# Altium schematic sheet 12V_Converter.SchDoc
size A; SheetNumber: 4; SheetTotal: 8
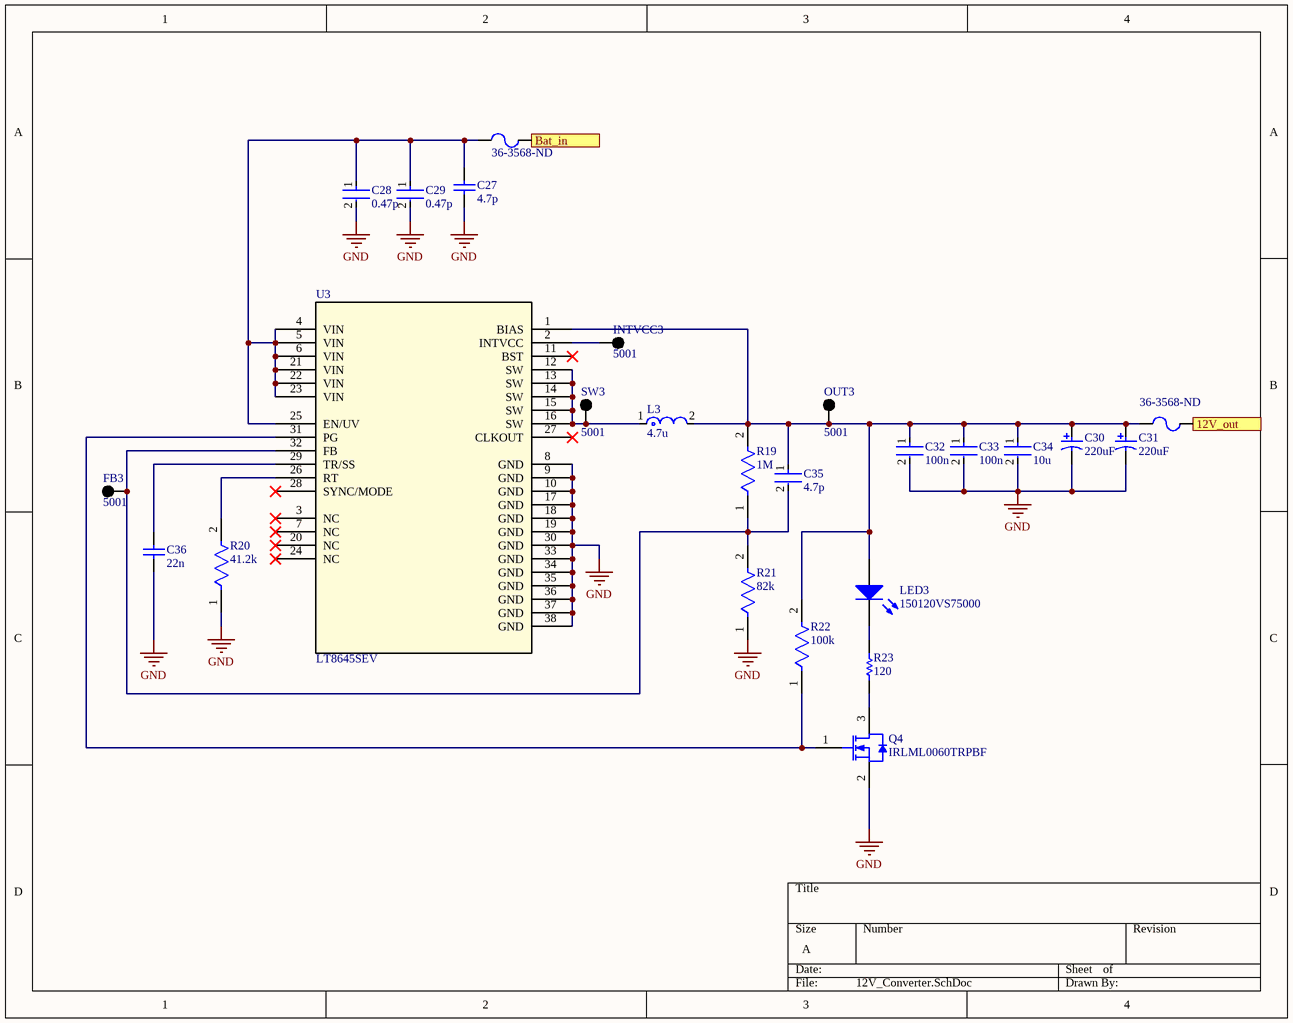
[diagram p0: 12V_Converter.SchDoc]

## Parts
C27  4.7p  [CAPC1608X90X35ML10T15]
C28  0.47p  [FP-CL21-IPC_B]
C29  0.47p  [FP-CL21-IPC_B]
C30  220uF  [CAPPR65-500-1250X1000X1350]
C31  220uF  [CAPPR65-500-1250X1000X1350]
C32  100n  [FP-CL10-IPC_A]
C33  100n  [FP-CL10-IPC_A]
C34  10u  [FP-CGA6P-IPC_A]
C35  4.7p  [FP-0603-L_1_6_0_15-W_0_81-MFG]
C36  22n  [CAPC1608X90X35ML10T15]
F5  36-3568-ND  [PCBComponent_1]
F6  36-3568-ND  [PCBComponent_1]
FB3  5001  [KSTN-5001]
INTVCC3  5001  [KSTN-5001]
L3  4.7u  [FP-XAL6060-472MEC-MFG]
LED3  150120VS75000  [1206_A]
OUT3  5001  [KSTN-5001]
Q4  IRLML0060TRPBF  [INTR-SOT-23-3_V]
R19  1M  [FP-CRCW0603-e3-MFG]
R20  41.2k  [FP-CRCW0603-e3-MFG]
R21  82k  [FP-CRCW0603-e3-IPC_C]
R22  100k  [FP-RC0603-0_55-MFG]
R23  120  [RESC1609X55X30ML15T15]
SW3  5001  [KSTN-5001]
U3  LT8645SEV  [LQFN-32]

## Ports
12V_out (out), Bat_in (in)

## Nets
GND: C27.1 C28.2 C29.2 C30.2 C31.2 C32.2 C33.2 C34.2 C36.1 Q4.2(S) R20.1 R21.1 U3.8(GND) U3.9(GND) U3.10(GND) U3.17(GND) U3.18(GND) U3.19(GND) U3.30(GND) U3.33(GND) U3.34(GND) U3.35(GND) U3.36(GND) U3.37(GND) U3.38(GND)
12V_out: F6.2 ; port 12V_out
Bat_in: F5.2 ; port Bat_in
NetC27_2: C27.2 C28.1 C29.1 F5.1 U3.4(VIN) U3.5(VIN) U3.6(VIN) U3.21(VIN) U3.22(VIN) U3.23(VIN) U3.25(EN/UV)
NetC30_1: C30.1 C31.1 C32.1 C33.1 C34.1 C35.1 F6.1 L3.2 LED3.2(A) OUT3.1 R19.2 R22.2 U3.1(BIAS)
NetC35_2: C35.2 FB3.1 R19.1 R21.2 U3.32(FB)
NetC36_2: C36.2 U3.29(TR/SS)
NetINTVCC3_1: INTVCC3.1 U3.2(INTVCC)
NetL3_1: L3.1 SW3.1 U3.12(SW) U3.13(SW) U3.14(SW) U3.15(SW) U3.16(SW)
NetLED3_1: LED3.1(K) R23.2
NetQ4_1: Q4.1(G) R22.1 U3.31(PG)
NetQ4_3: Q4.3(D) R23.1
NetR20_2: R20.2 U3.26(RT)

Not connected (* = marked no-connect by the designer): U3 3(NC)* 7(NC)* 11(BST)* 20(NC)* 24(NC)* 27(CLKOUT)* 28(SYNC/MODE)*

## Library data of the parts
C27 = CMP-2006-02676-1: Part Number: GRM1885C1H4R7CA01D; Manufacturer: Murata
C28 C29 = CMP-13271-000950-1: CL21 Series 0805 0.47pF 50V ±0.1pF Tolerance C0G Multilayer Ceramic Chip Capacitor; Temperature Coefficient: 300ppm/°C; Length: 2mm; Case Code (Metric): 2012; Width: 0.049inch; Case Code (Imperial): 0805; Radiation Hardening: No; Voltage: 50V; Height: 0.65mm; Voltage Rating (DC): 50V; Package Quantity: 1; Capacitance: 0.47pF; Voltage Rating: 50V; Max Operating Temperature: 125°C; Min Operating Temperature: -55°C; Dielectric: C0G; Depth: 1.25mm; Thickness: 0.03inch; Lead Free: Lead Free; Packaging: Tape and Reel; Case/Package: 0805; Mount: Surface Mount
C30 C31 = CMP-1665-00043-1: Aluminum Electrolytic Capacitor, 220 uF, +/- 20%, 50 V, -40 to 85 degC, 2-Pin THD, RoHS, Bulk; Max Supply Voltage: 5.5 V; Min Supply Voltage: 4.5 V; Propagation Delay: 10 us; Data Rate: 120 kbps; Nominal Supply Current: 10 mA; Case\Package: SOIC; Nominal Supply Voltage: 5 V; Channels: 2; Interface: RS-232; Width: 4 mm; Packaging: Rail/Tube; ComponentLink2Description: Datasheet; Height: 1.5 mm; PackageReference: CAPPR65-500-1250X1000X1350; Pins: 16; DatasheetVersion: Mar-16; Max Operating Temperature: 70 degC; Length: 10 mm; REACH SVHC: No SVHC; ComponentLink1Description: Manufacturer URL; Package Quantity: 50; ComponentLink2URL: http://industrial.panasonic.com/cdbs/www-data/pdf/RDF0000/DMF0000COL68.pdf; ComponentLink1URL: http://www.panasonic.com/; PackageDescription: 2-Pin Radial Lead, Dia 10 mm, Body Length 12.5 mm; Min Operating Temperature: 0 degC; Radiation Hardening: No; RoHSCompliant: true; Mount: Surface Mount
C32 C33 = CMP-13271-000587-1: Cap Ceramic 100nF 50V X7R ±10% Pad SMD 0603 +125°C T/R; Case/Package: 0603; Depth: 0.8mm; Max Operating Temperature: 125°C; Lead Free: Lead Free; Material: Ceramic; Voltage Rating: 50V; Min Operating Temperature: -55°C; Voltage Rating (DC): 50V; Dielectric: X7R; Height: 0.8mm; Capacitance: 100nF; Thickness: 0.035inch; Radiation Hardening: No; Voltage: 50V; Packaging: Tape and Reel; Length: 1.6mm; Tolerance: 10%; Width: 0.031inch; Mount: Surface Mount; Package Quantity: 10000
C34 = CMP-2000-07444-2: Cap Ceramic 10uF 50V X7S 10% Pad SMD 1210 +125°C Automotive T/R; Width: 0.098inch; Depth: 2.5mm; Capacitance: 10uF; Case Code (Metric): 3225; Case/Package: 1210; Voltage Rating: 50V; Composition: Ceramic; Min Operating Temperature: -55°C; Termination: SMD/SMT; Dielectric: X7S; Max Operating Temperature: 125°C; Length: 3.2mm; Mount: Surface Mount; Packaging: Tape and Reel; Voltage Rating (DC): 50V; Package Quantity: 1; Height: 2.5mm; Case Code (Imperial): 1210; Weight: 0.000564oz; Lead Free: Lead Free; Thickness: 0.11inch; REACH SVHC: No SVHC; Tolerance: 10%; Voltage: 50V; Ratings: AEC-Q200
C35 = CMP-2006-04327-2: General Purpose Ceramic Capacitor, 0603, 4.7pF, 0.25pF, NP0, 30ppm/°C, 50V; Insulation Resistance: 100GR; Dielectric: C0G; Case/Package: 0603; RoHS Compliant: Yes; Case Code (Imperial): 0603; Contact Plating: Tin; REACH SVHC: No SVHC; Construction: Flat; Voltage Rating: 50V; Case Code (Metric): 1608; Min Operating Temperature: -55°C; Termination: SMD/SMT; Max Operating Temperature: 125°C; Capacitance: 4.7pF; Depth: 0.81mm; Radiation Hardening: No; Lead Free: Lead Free; Mount: Surface Mount; Thickness: 0.035inch; Width: 0.81mm; Series: -; Package Quantity: 4000; Packaging: Tape and Reel; Number of Pins: 2; Temperature Coefficient: 30ppm/°C; Voltage Rating (DC): 50V; Height: 0.86mm; Length: 1.6mm
C36 = CMP-2006-02910-1: Manufacturer: Murata; Part Number: GRM188R71H223KA01D
F5 F6 = Fuse_Holder
FB3 = CMP-2000-05181-1: Test Point, Black, 1-Pin THD, RoHS, Bulk; Manufacturer: Keystone; Other Names: 5001K; Catalog Drawings: 5000Series; Alternate Color: 5004K-ND / -TESTPOINTPCMINI.040"DYELLOW / 5003K-ND / -TESTPOINTPCMINI.040"DORANGE / 5002K-ND / -TESTPOINTPCMINI.040"DWHITE / 5000K-ND / -TESTPOINTPCMINI.040"DRED; Kits: DKTGRS232C-KIT-ND / -TTLCONVERTER; Material: Base,Nylon46,UL94V-0; Type: PCTestPoint,Miniature; Online Catalog: ColorCodedTestPoints; Datasheet URL: https://ciiva.com/datasheet-click-2917627?src=ciiva&sig=bd195616; Mounting Type: 0.040"(1.02mm)HoleDiameter; Family: TestPoints; RoHS Information: RoHSComplianceStatement; Datasheet Version: Rev. G, 12/2008; Color: Black; Category: TestandMeasurement; Standard Package: 100; Manufacturer URL: http://www.keyelco.com/; Terminal: 0.010"x0.020"(0.25mmx0.51mm)PhosphorBronzeWire,SilverPlated; Series: THM; Packaging: Bulk
INTVCC3 OUT3 SW3 = CMP-2000-05181-1: Test Point, Black, 1-Pin THD, RoHS, Bulk; Manufacturer: Keystone; Other Names: 5001K; Catalog Drawings: 5000Series; Alternate Color: 5004K-ND / -TESTPOINTPCMINI.040"DYELLOW / 5003K-ND / -TESTPOINTPCMINI.040"DORANGE / 5002K-ND / -TESTPOINTPCMINI.040"DWHITE / 5000K-ND / -TESTPOINTPCMINI.040"DRED; Kits: DKTGRS232C-KIT-ND / -TTLCONVERTER; Online Catalog: ColorCodedTestPoints; Datasheet URL: https://ciiva.com/datasheet-click-2917627?src=ciiva&sig=bd195616; Mounting Type: 0.040"(1.02mm)HoleDiameter; Family: TestPoints; RoHS Information: RoHSComplianceStatement; Datasheet Version: Rev. G, 12/2008; Color: Black; Category: TestandMeasurement; Standard Package: 100; Manufacturer URL: http://www.keyelco.com/; Material: Base,Nylon46,UL94V-0; Type: PCTestPoint,Miniature; Terminal: 0.010"x0.020"(0.25mmx0.51mm)PhosphorBronzeWire,SilverPlated; Series: THM; Packaging: Bulk
L3 = CMP-11268-000140-1: Surface Mount Power Inductor, AEC-Q200 XAL6060 Series, 4.7 H, 20%, Shielded, 0.0144 ohm, 11 A; Inductance: 4.7uH; Core Material: Composite; Max DC Current: 11A; Test Frequency: 100kHz; Saturation Current: 10.5A; Self Resonant Frequency: 21MHz; DC Resistance (DCR): 14.4mR; Mount: Surface Mount; Shielding: Shielded; Lead Free: Contains Lead; Tolerance: 20%; Case/Package: SMD/SMT; Packaging: Tape and Reel; Height: 6.1mm; Package Quantity: 250; Termination: SMD/SMT; Length: 6.76mm; Series: XAL6060; RMS Current (Irms): 11A; Width: 6.56mm; Min Operating Temperature: -40°C; Max Operating Temperature: 125°C; Inductance Tolerance: 20%; RoHS Compliant: Yes
LED3 = CMP-1426-00016-1: SMD mono-color Chip LED, WL-SMCW, Bright Green; Manufacturer: Wuerth Elektronik; ComponentLink2URL: http://katalog.we-online.com/led/datasheet/150120VS75000.pdf; PartNumber: 150120VS75000; Color: Bright Green; ComponentLink2Description: Datasheet; ComponentLink1URL: http://www.we-online.com; PackageReference: 1206_A; ComponentLink1Description: Manufacturer URL
Q4 = CMP-2000-06485-1: HEXFET Power MOSFET / , 60 V, 2.7 A, -55 to 150 degC, 3-Pin SOT-23, RoHS, Tape and Reel; Manufacturer: International Rectifier; Maximum Gate Source Voltage: ±16V; Typical Turn On Delay Time: 5.4ns; Number of Elements per Chip: 1; Maximum Power Dissipation: 1.25W; Maximum Continuous Drain Current: 2.7A; Typical Gate Charge @ Vgs: 2.5nC@4.5V; Configuration: Single; Channel Type: N; Forward Transconductance: 7.6S; Channel Mode: Enhancement; Typical Input Capacitance @ Vds: 290pF@25V; Typical TurnOff Delay Time: 6.8ns; Maximum Drain Source Voltage: 60V; Maximum Drain Source Resistance: 92mΩ; Forward Diode Voltage: 1.3V; Length: 3.04mm; Width: 1.4mm; Series: HEXFET®Series; Category: PowerMOSFET; Datasheet Version: 03/2012; Operating Temperature Range: -55to+150°C; Height: 1.02mm; Package Type: Micro8; Mounting Technology: SurfaceMount; Package Reference: SOT-23-3; Datasheet URL: http://www.infineon.com/dgdl/irlml0060pbf.pdf?fileId=5546d462533600a40153566493ef25e6; Mounting Type: SurfaceMount; Maximum Operating Temperature: +150°C; Dimensions: 3.04x1.40x1.02mm; Minimum Operating Temperature: -55°C; Manufacturer URL: http://internationalrectifier.com/; Pin Count: 3; Package Description: 3-Pin Small Outline Transistor, Body 2.92 x 1.3 mm, Pitch 0.95 mm
R19 = CMP-2000-03013-2: RES Thick Film, 1MΩ, 1%, 0.1W, 100ppm/°C, 0603; Max Power Dissipation: 100mW; Resistance: 1MR; Voltage Rating (DC): 75V; Depth: 0.85mm; Max Operating Temperature: 155°C; Length: 1.55mm; Power Rating: 100mW; Military Standard: Not; Features: Automotive AEC-Q200; Min Operating Temperature: -55°C; Number of Pins: 2; Mount: Surface Mount; Package Quantity: 10; Packaging: Tape and Reel; Height: 0.45mm; Radiation Hardening: No; Case Code (Metric): 1608; Temperature Coefficient: 100ppm/°C; Width: 0.85mm; Composition: Thick Film; Termination: SMD/SMT; Tolerance: 1%; Number of Terminations: 2; Lead Free: Lead Free; Contact Plating: Tin; Case/Package: 0603; Weight: 7.1E-05oz; Voltage Rating: 75V; Case Code (Imperial): 0603
R20 = CMP-1012-00692-3: RES Thick Film, 41.2kΩ, 1%, 0.1W, 100ppm/°C, 0603; Voltage Rating: 75V; Max Power Dissipation: 100mW; Resistance: 41.2kR; Military Standard: Not; Radiation Hardening: No; Packaging: Tape and Reel; Max Operating Temperature: 155°C; Case Code (Metric): 1608; Contact Plating: Tin; Case Code (Imperial): 0603; Package Quantity: 10; Features: Automotive AEC-Q200; Min Operating Temperature: -55°C; Voltage Rating (DC): 75V; Tolerance: 1%; Termination: SMD/SMT; Mount: Surface Mount; Temperature Coefficient: 100ppm/°C; Number of Terminations: 2; Depth: 0.85mm; Height: 0.45mm; Length: 1.55mm; Width: 0.033inch; Weight: 7.1E-05oz; Composition: Thick Film; Power Rating: 100mW; Case/Package: 0603; Lead Free: Lead Free
R21 = CMP-2000-03602-2: RES Thick Film, 82kΩ, 1%, 0.1W, 100ppm/°C, 0603; Voltage Rating (DC): 75V; Power Rating: 100mW; Resistance: 82kR; Case Code (Metric): 1608; Contact Plating: Tin; Case Code (Imperial): 0603; Number of Terminations: 2; Tolerance: 1%; Case/Package: 0603; Military Standard: Not; Max Operating Temperature: 155°C; Height: 0.45mm; Voltage Rating: 75V; Termination: SMD/SMT; Radiation Hardening: No; Width: 0.85mm; Max Power Dissipation: 100mW; Features: Automotive AEC-Q200; Package Quantity: 10; Lead Free: Lead Free; Min Operating Temperature: -55°C; Temperature Coefficient: 100ppm/°C; Composition: Thick Film; Length: 1.55mm; Depth: 0.85mm; Working Voltage: 75V; Number of Pins: 2; Weight: 7.1E-05oz; Packaging: Tape and Reel
R22 = CMP-2100-03662-2: RES SMD 100K OHM 1% 1/10W 0603; Voltage Rating (DC): 50V; Resistance: 100kR; Max Power Dissipation: 100mW; Temperature Coefficient: 100ppm/°C; Working Voltage: 75V; Length: 1.6mm; Lead Free: Lead Free; Number of Terminations: 2; Packaging: Tape and Reel; Voltage Rating: 50V; Termination: SMD/SMT; Width: 0.8mm; Resistor Type: Thick Film; Resistance Tolerance: 1%; Features: Moisture Resistant; Height: 0.45mm; Construction: Rectangular; Case/Package: 0603; Military Standard: Not; Case Code (Imperial): 0603; Series: RC; Technology: THICK FILM; Depth: 0.8mm; RoHS Compliant: Yes; REACH SVHC: No SVHC; Min Operating Temperature: -55°C; Case Code (Metric): 1608; Max Operating Temperature: 155°C; Power Rating: 100mW; Number of Pins: 2; Tolerance: 1%
R23 = CMP-2000-00213-2: Chip Resistor, 120 Ohm, +/- 1%, 0.1 W, -55 to 155 degC, 0603 (1608 Metric), RoHS, Tape and Reel; Manufacturer: Panasonic; Power Rating: 100mW; Voltage Rating (DC): 75V; Resistance: 120Ohm; Temperature Coefficient: 100ppm/degreesC; Number of Terminations: 2; Military Standard: Not; Tolerance: 1%; Min Operating Temperature: -55degC; Packaging: TapeandReel; Lead Free: LeadFree; Max Operating Temperature: 155degC; Manufacturer URL: http://www.panasonic.com/; Case Code (Imperial): 0603; REACH SVHC: NoSVHC; Width: 0.031inch; Datasheet URL: https://industrial.panasonic.com/cdbs/www-data/pdf/RDA0000/AOA0000C283.pdf; RoHSCompliant: true; Max Power Dissipation: 100mW; Termination: SMD/SMT; Package Reference: 0603; Height: 0.022inch; Depth: 0.8mm; Package Description: 2-Pin Surface Mount Device, Body 1.6 x 0.85 mm; Contact Plating: Tin; Length: 1.6mm; Package URL: http://www.st.com/st-web-ui/static/active/en/resource/technical/document/datasheet/CD00001320.pdf; Radiation Hardening: No; Package Quantity: 1; Number of Pins: 2; Datasheet Version: 42095.0; Voltage Rating: 75V; Composition: ThickFilm; Case/Package: 0603; Mount: SurfaceMount; Case Code (Metric): 1608
U3 = LT8645SEV: No Description Available; Copyright: Copyright (C) 2018 Accelerated Designs. All rights reserved; RefDes: RefDes; Type: DEV; Value: Value